# Altium schematic sheet Sheet4.SchDoc: D AMP
size A4; Revision: 1.0; SheetNumber: 4; SheetTotal: 5
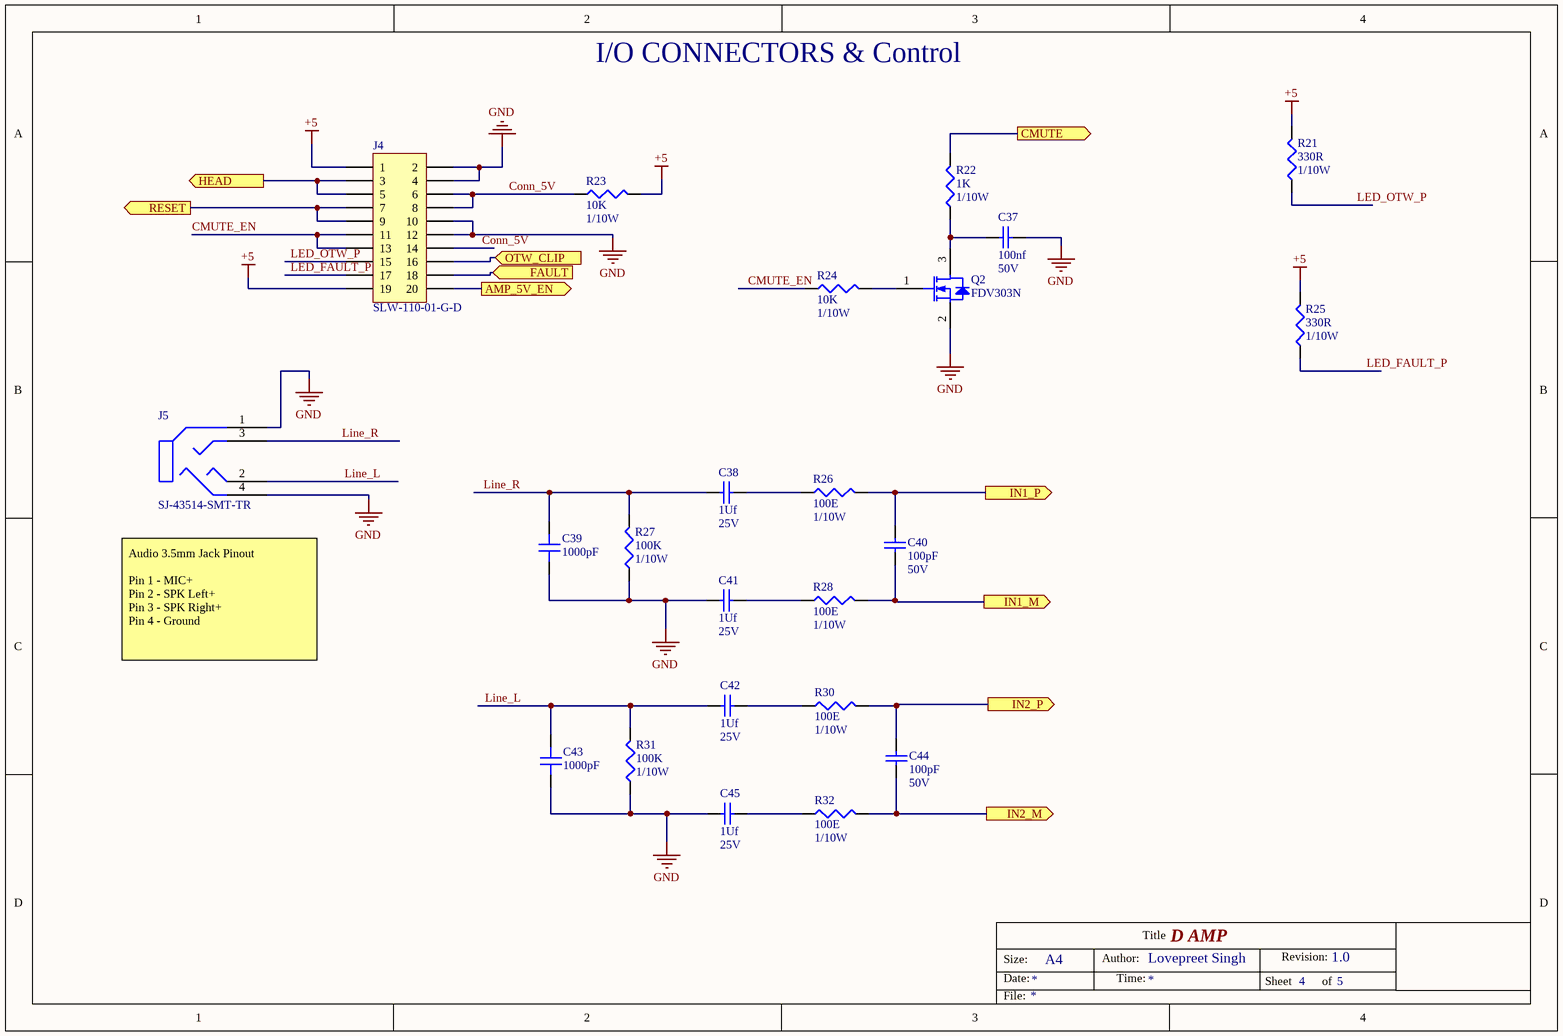
[diagram p0: Sheet4.SchDoc]

## Parts
C37  100nf  VRating: 50V  [C0603]
C38  1Uf  VRating: 25V  [C0603]
C39  1000pF  [CAP 0603_1608]
C40  100pF  VRating: 50V  [C0603]
C41  1Uf  VRating: 25V  [C0603]
C42  1Uf  VRating: 25V  [C0603]
C43  1000pF  [CAP 0603_1608]
C44  100pF  VRating: 50V  [C0603]
C45  1Uf  VRating: 25V  [C0603]
J4  SLW-110-01-G-D  [HDR2X10]
J5  SJ-43514-SMT-TR  [CUI SJ-43514-SMT-TR]
Q2  FDV303N  [SOT23_123]
R21  330R  PRating: 1/10W  [R0603]
R22  1K  PRating: 1/10W  [R0603]
R23  10K  PRating: 1/10W  [R0603]
R24  10K  PRating: 1/10W  [R0603]
R25  330R  PRating: 1/10W  [R0603]
R26  100E  PRating: 1/10W  [R0603]
R27  100K  PRating: 1/10W  [R0603]
R28  100E  PRating: 1/10W  [R0603]
R30  100E  PRating: 1/10W  [R0603]
R31  100K  PRating: 1/10W  [R0603]
R32  100E  PRating: 1/10W  [R0603]

## Ports
AMP_5V_EN (out), CMUTE (out), FAULT (in), HEAD (out), IN1_M (out), IN1_P (out), IN2_M (out), IN2_P (out), OTW_CLIP (in), RESET (out)

## Nets
+5: J4.1 J4.19 R21.2 R23.2 R25.2
GND: C37.2 C39.1 C41.1 C43.1 C45.1 J4.2 J4.4 J4.10 J4.12 J5.1(SLEEVE) J5.4(RING_2) Q2.2(S) R27.1 R31.1
AMP_5V_EN: J4.20 ; port AMP_5V_EN
CMUTE: R22.2 ; port CMUTE
CMUTE_EN: J4.11 J4.13 R24.1
Conn_5V: J4.6 J4.8 J4.14 R23.1
FAULT: J4.18 ; port FAULT
HEAD: J4.3 J4.5 ; port HEAD
IN1_M: C40.1 R28.2 ; port IN1_M
IN1_P: C40.2 R26.2 ; port IN1_P
IN2_M: C44.1 R32.2 ; port IN2_M
IN2_P: C44.2 R30.2 ; port IN2_P
LED_FAULT_P: J4.17 R25.1
LED_OTW_P: J4.15 R21.1
Line_L: C42.1 C43.2 J5.2(TIP) R31.2
Line_R: C38.1 C39.2 J5.3(RING_1) R27.2
OTW_CLIP: J4.16 ; port OTW_CLIP
RESET: J4.7 J4.9 ; port RESET
NetC37_1: C37.1 Q2.3(D) R22.1
NetC38_2: C38.2 R26.1
NetC41_2: C41.2 R28.1
NetC42_2: C42.2 R30.1
NetC45_2: C45.2 R32.1
NetQ2_1: Q2.1(G) R24.2

## Notes on the sheet
- I/O CONNECTORS & Control
- (near J5) Audio 3.5mm Jack Pinout
  Pin 1 - MIC+
  Pin 2 - SPK Left+
  Pin 3 - SPK Right+
  Pin 4 - Ground
- Size:
- Date:
- A4
- Author:
- Time:
- Title
- Lovepreet Singh
- Sheet
- Revision:
- of
- File:

## Library data of the parts
C37 = CAP-00018: CAP CER 100NF 10% 50V X7R 0603; Manufacturer 1: Yageo; Manufacturer 1 PN: CC0603KRX7R9BB104; Manufacturer 2 PN: GRM188R71H104KA93D; Manufacturer 3 PN: 06035C104KAT2A; SAP PN: 1100013274; SMD/TH: SMD; PB-Free: UNKNOWN; DB Ref: CAP-00018; Life Cycle: Released; Value: 100nf; Tolerence: 10%; TRating: X7R; Manufacturer 2: Murata; Manufacturer 3: AVX; ROHS Comp: YES; Operating Temp: -55°C to +125°C; Grade: UNKNOWN
C38 C41 C42 C45 = CAP-00113: CAP MLCC SMD 25V 1uF 10% X7R 0603; Manufacturer 1: KEMET; Manufacturer 1 PN: C0603C105K3RACTU; SAP PN: 1100016000; PB-Free: YES; Grade: Commercial; DB Ref: CAP-00113; Life Cycle: Released; Value: 1Uf; Tolerence: 10%; TRating: X7R; ROHS Comp: YES; Operating Temp: -55°C to +125°C; SMD/TH: SMD
C39 C43 = C0603C102K4RECAUTO: CAP CER 0603 1NF 16V X7R 10%; Manufacturer: KEMET; Part Number: C0603C102K4RECAUTO; Value: 1000pF; Applications: Automotive, ESD Protection; Capacitance: 1000pF; ComponentLink1Description: Datasheet; ComponentLink1URL: https://api.kemet.com/component-edge/download/datasheet/C0603C102K4RECAUTO.pdf; ComponentLink2Description: DigiKey Link; ComponentLink2URL: http://digikey.com/product-detail/en/kemet/C0603C102K4RECAUTO/399-17878-1-ND/8640545; Device Package: 0603 (1608 Metric); LastUpdated: 02-09-2020 01:03:36 AM; Lifecycle Status: Active; Minimum Order: 1; Mounting Type: Surface Mount, MLCC; Operating Temperature: -55°C ~ 125°C; Package / Case: 0603 (1608 Metric); Packaging: TapeAndReel; PartId: 2316; Part Status: Active; Price: 0.02; Ratings: AEC-Q200; Series: ESD SMD Auto X7R; Size / Dimension: 0.063" L x 0.031" W (1.60mm x 0.80mm); Supplier 1: DigiKey; Supplier Part Number 1: 399-17878-1-ND; Temperature Coefficient: X7R; Thickness (Max): 0.034" (0.87mm); Tolerance: ±10%; Voltage - Rated: 16V
C40 C44 = CAP-00096: CAP 100PF 5% 50V 0603; Manufacturer 1: YAGEO; Manufacturer 1 PN: CC0603JRNPO9BN101; Manufacturer 2 PN: 06035A101JAT4A; SAP PN: 1100015745; TRating: C0G(NPO); SMD/TH: SMD; PB-Free: UNKNOWN; DB Ref: CAP-00096; Life Cycle: Released; Value: 100pF; Tolerence: 5%; Manufacturer 2: AVX; ROHS Comp: YES; Operating Temp: -55°C to +125°C; Grade: UNKNOWN
J4 = CON-00033: CONN HSG 20PIN 2.54MM STR DUALROW; Manufacturer 1: Samtec; SAP PN: 1100014978; Current Rating: 5.2A; SMD/TH: TH; PB-Free: UNKNOWN; DB Ref: CON-00033; Life Cycle: Released; Manufacturer 1 PN: SLW-110-01-G-D; ROHS Comp: YES; Operating Temp: -55°C to +120°C; Grade: UNKNOWN
J5 = SJ-43514-SMT-TR: CONN JACK 4COND 3.5MM SMD R/A; Manufacturer: CUI Devices; Actual Diameter: 0.142" (3.60mm); Connector Type: Phone Jack; Gender: Female; Industry Recognized Mating Diameter: 3.50mm (0.141", 1/8", Mini Plug) - Headphone; Internal Switch(s): Does Not Contain Switch; Number of Positions/Contacts: 4 Conductors, 4 Contacts; Shielding: Unshielded; Signal Lines: Stereo (4 Conductor, TRRS); Part Number: SJ-43514-SMT-TR; ComponentLink1Description: Datasheet; ComponentLink1URL: https://www.cuidevices.com/product/resource/digikeypdf/sj-4351x-smt.pdf; ComponentLink2Description: DigiKey Link; ComponentLink2URL: http://digikey.com/product-detail/en/cui-devices/SJ-43514-SMT-TR/CP-43514SJCT-ND/669734; Features: Board Guide; LastUpdated: 06-09-2020 11:26:53 AM; Lifecycle Status: Active; Minimum Order: 1; Mounting Type: Surface Mount, Right Angle; Operating Temperature: -20°C ~ 85°C; Packaging: TapeAndReel; Part Status: Active; Price: 0.58; Series: SJ; Supplier 1: DigiKey; Supplier Part Number 1: CP-43514SJCT-ND; Termination: Solder
Q2 = TRS-00003: TRANS N-CH MOSFET 25V 0.68A SOT23; Manufacturer 1: Fairchild; SAP PN: 1100013323; Type: NMOS; SMD/TH: SMD; Grade: UNKNOWN; DB Ref: TRS-00003; Life Cycle: Released; VRating: 25V; Irating: 0.68A; Manufacturer 1 PN: FDV303N; ROHS Comp: YES; Operating Temp: -55°C to +150°C; Storage Temp: -55°C to +150°C; PB-Free: UNKNOWN
R21 R25 = RES-00132: RES  SMD 330R 5% 1/10W 0603; Manufacturer 1: YAGEO; Manufacturer 1 PN: RC0603JR-07330RL; Manufacturer 2 PN: AC0603JR-07330RL; Manufacturer 3 PN: ERJ-3GEYJ331V; SAP PN: 1100015977; Tolerance(%): 5; Grade: UNKNOWN; DB Ref: RES-00132; Life Cycle: Released; Value: 330R; Manufacturer 2: YAGEO; Manufacturer 3: Panasonic; ROHS Comp: YES; Operating Temp: -55°C to +155°C; SMD/TH: SMD; PB-Free: UNKNOWN
R22 = RES-00017: RES SMD 1K 1% 1/10W 0603; Manufacturer 1: Yageo; Manufacturer 1 PN: RC0603FR-071KL; Manufacturer 2 PN: RMCF0603FT1K00; Manufacturer 3 PN: ERJ-PA3F1001V; SAP PN: 1100013331; Tolerance(%): 1; Grade: UNKNOWN; DB Ref: RES-00017; Life Cycle: Released; Value: 1K; Manufacturer 2: Stackpole; Manufacturer 3: PANASONIC; ROHS Comp: YES; Operating Temp: -55°C to +155°C; SMD/TH: SMD; PB-Free: UNKNOWN
R23 R24 = RES-00012: RES SMD 10K 1% 1/10W 0603; Manufacturer 1: Yageo; Manufacturer 1 PN: RC0603FR-0710KL; Manufacturer 2 PN: ERJ-3EKF1002V; Manufacturer 3 PN: RK73H1JRTTD1002F; SAP PN: 1100013326; Tolerance(%): 1; Grade: UNKNOWN; DB Ref: RES-00012; Life Cycle: Released; Value: 10K; Manufacturer 2: Panasonic; Manufacturer 3: KOA Speer; ROHS Comp: YES; Operating Temp: -55°C to +155°C; SMD/TH: SMD; PB-Free: UNKNOWN
R26 R28 R30 R32 = RES-00018: RES SMD 100E 1% 1/10W 0603; Manufacturer 1: Yageo; Manufacturer 1 PN: RC0603FR-07100RL; Manufacturer 2 PN: RK73H1JRTTD1000F; Manufacturer 3 PN: 0603WAF1000T5E; SAP PN: 1100013332; Tolerance(%): 1; Grade: UNKNOWN; DB Ref: RES-00018; Life Cycle: Released; Value: 100E; Manufacturer 2: KOA Speer; Manufacturer 3: ROYAL OHM; ROHS Comp: YES; Operating Temp: -55°C to +155°C; SMD/TH: SMD; PB-Free: UNKNOWN
R27 R31 = RES-00024: RES SMD 100K 1% 1/10W 0603; Manufacturer 1: Yageo; Manufacturer 1 PN: RC0603FR-07100KL; Manufacturer 2 PN: RMCF0603FT100K; Manufacturer 3 PN: RK73H1JRTTD1003F; SAP PN: 1100013339; Tolerance(%): 1; Cost Price: $0.1; Grade: UNKNOWN; DB Ref: RES-00024; Life Cycle: Released; Value: 100K; Manufacturer 2: Stackpole; Manufacturer 3: KOA Speer; ROHS Comp: YES; Operating Temp: -55°C to +155°C; SMD/TH: SMD; PB-Free: UNKNOWN